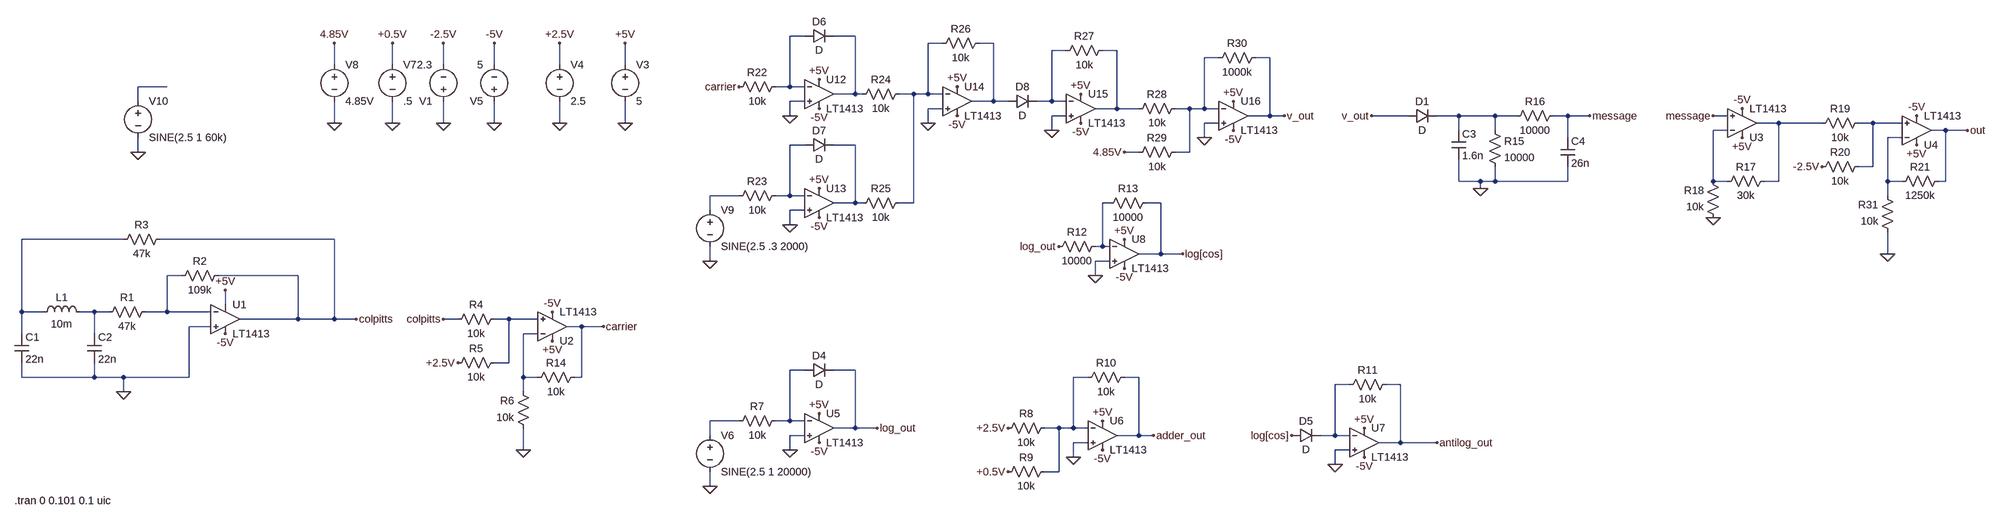
[diagram p0: schematic Draft1.asc]
Draft1.asc, the LTspice schematic file:
Version 4
SHEET 1 2880 1136
WIRE -16 -160 -48 -160
WIRE 96 -160 48 -160
WIRE 288 -144 256 -144
WIRE 400 -144 368 -144
WIRE 560 -128 528 -128
WIRE 672 -128 640 -128
WIRE 896 -112 864 -112
WIRE 1008 -112 976 -112
WIRE -1056 -96 -1056 -144
WIRE -928 -96 -928 -144
WIRE -816 -96 -816 -144
WIRE -704 -96 -704 -144
WIRE -560 -96 -560 -144
WIRE -416 -96 -416 -144
WIRE -1424 -48 -1488 -48
WIRE -48 -48 -48 -160
WIRE -48 -48 -80 -48
WIRE -16 -48 -48 -48
WIRE 96 -32 96 -160
WIRE 96 -32 48 -32
WIRE 112 -32 96 -32
WIRE 224 -32 192 -32
WIRE 256 -32 256 -144
WIRE 256 -32 224 -32
WIRE 288 -32 256 -32
WIRE -1488 -16 -1488 -48
WIRE -16 -16 -48 -16
WIRE 400 -16 400 -144
WIRE 400 -16 352 -16
WIRE 432 -16 400 -16
WIRE 528 -16 528 -128
WIRE 528 -16 496 -16
WIRE 560 -16 528 -16
WIRE 288 0 256 0
WIRE 672 0 672 -128
WIRE 672 0 624 0
WIRE 720 0 672 0
WIRE 832 0 800 0
WIRE 864 0 864 -112
WIRE 864 0 832 0
WIRE 896 0 864 0
WIRE -48 16 -48 -16
WIRE 560 16 528 16
WIRE 1008 16 1008 -112
WIRE 1008 16 960 16
WIRE 1040 16 1008 16
WIRE 1312 16 1232 16
WIRE 1424 16 1376 16
WIRE 1504 16 1424 16
WIRE 1552 16 1504 16
WIRE 1664 16 1632 16
WIRE 1712 16 1664 16
WIRE 2016 16 1984 16
WIRE -1056 32 -1056 -16
WIRE -928 32 -928 -16
WIRE -816 32 -816 -16
WIRE -704 32 -704 -16
WIRE -560 32 -560 -16
WIRE -416 32 -416 -16
WIRE 256 32 256 0
WIRE 896 32 864 32
WIRE 2128 32 2080 32
WIRE 2224 32 2128 32
WIRE 2336 32 2304 32
WIRE 2400 32 2336 32
WIRE 528 48 528 16
WIRE 1424 48 1424 16
WIRE 1504 48 1504 16
WIRE 2016 48 1984 48
WIRE 2496 48 2464 48
WIRE 2544 48 2496 48
WIRE 864 64 864 32
WIRE 1664 64 1664 16
WIRE 2400 64 2368 64
WIRE -16 80 -48 80
WIRE 96 80 48 80
WIRE -1488 96 -1488 64
WIRE 720 96 688 96
WIRE 832 96 832 0
WIRE 832 96 800 96
WIRE 2336 128 2336 32
WIRE 2336 128 2304 128
WIRE 1424 160 1424 112
WIRE 1472 160 1424 160
WIRE 1504 160 1504 128
WIRE 1504 160 1472 160
WIRE 1664 160 1664 128
WIRE 1664 160 1504 160
WIRE 1984 160 1984 48
WIRE 2016 160 1984 160
WIRE 2128 160 2128 32
WIRE 2128 160 2096 160
WIRE 2368 160 2368 64
WIRE 2400 160 2368 160
WIRE 2496 160 2496 48
WIRE 2496 160 2480 160
WIRE 1472 176 1472 160
WIRE -160 192 -224 192
WIRE -48 192 -48 80
WIRE -48 192 -80 192
WIRE -16 192 -48 192
WIRE 2368 192 2368 160
WIRE 96 208 96 80
WIRE 96 208 48 208
WIRE 112 208 96 208
WIRE 224 208 224 -32
WIRE 224 208 192 208
WIRE 656 208 640 208
WIRE 768 208 736 208
WIRE -224 224 -224 192
WIRE -16 224 -48 224
WIRE -48 256 -48 224
WIRE -1520 288 -1744 288
WIRE -1056 288 -1440 288
WIRE 640 304 640 208
WIRE 640 304 624 304
WIRE 656 304 640 304
WIRE 768 320 768 208
WIRE 768 320 720 320
WIRE 816 320 768 320
WIRE 2368 320 2368 272
WIRE -224 336 -224 304
WIRE 656 336 624 336
WIRE -1392 368 -1424 368
WIRE -1136 368 -1312 368
WIRE 624 368 624 336
WIRE -1296 432 -1296 400
WIRE -1744 448 -1744 288
WIRE -1696 448 -1744 448
WIRE -1584 448 -1616 448
WIRE -1552 448 -1584 448
WIRE -1424 448 -1424 368
WIRE -1424 448 -1472 448
WIRE -1328 448 -1424 448
WIRE -1136 464 -1136 368
WIRE -1136 464 -1264 464
WIRE -1056 464 -1056 288
WIRE -1056 464 -1136 464
WIRE -1008 464 -1056 464
WIRE -784 464 -816 464
WIRE -672 464 -704 464
WIRE -608 464 -672 464
WIRE -1328 480 -1376 480
WIRE -512 480 -544 480
WIRE -464 480 -512 480
WIRE -1744 496 -1744 448
WIRE -1584 496 -1584 448
WIRE -608 496 -640 496
WIRE -672 560 -672 464
WIRE -672 560 -704 560
WIRE -16 576 -48 576
WIRE 96 576 48 576
WIRE -1744 592 -1744 560
WIRE -1584 592 -1584 560
WIRE -1584 592 -1744 592
WIRE -1520 592 -1584 592
WIRE -1376 592 -1376 480
WIRE -1376 592 -1520 592
WIRE -640 592 -640 496
WIRE -608 592 -640 592
WIRE -512 592 -512 480
WIRE -512 592 -528 592
WIRE 608 592 576 592
WIRE 720 592 688 592
WIRE 1184 608 1152 608
WIRE 1296 608 1264 608
WIRE -1520 624 -1520 592
WIRE -640 624 -640 592
WIRE -160 688 -224 688
WIRE -48 688 -48 576
WIRE -48 688 -80 688
WIRE -16 688 -48 688
WIRE 96 704 96 576
WIRE 96 704 48 704
WIRE 144 704 96 704
WIRE 544 704 512 704
WIRE 576 704 576 592
WIRE 576 704 544 704
WIRE 608 704 576 704
WIRE -224 720 -224 688
WIRE -16 720 -48 720
WIRE 720 720 720 592
WIRE 720 720 672 720
WIRE 752 720 720 720
WIRE 1152 720 1152 608
WIRE 1152 720 1120 720
WIRE 1184 720 1152 720
WIRE 608 736 576 736
WIRE 1296 736 1296 608
WIRE 1296 736 1248 736
WIRE 1376 736 1296 736
WIRE -640 752 -640 704
WIRE -48 752 -48 720
WIRE 1184 752 1152 752
WIRE 576 768 576 736
WIRE 1152 784 1152 752
WIRE 544 800 544 704
WIRE 544 800 512 800
WIRE -224 832 -224 800
FLAG -416 32 0
FLAG -560 32 0
FLAG -560 -144 +2.5V
FLAG -416 -144 +5V
FLAG -704 -144 -5V
FLAG -704 32 0
FLAG 16 672 +5V
FLAG 16 736 -5V
FLAG -48 752 0
FLAG -224 832 0
FLAG 144 704 log_out
FLAG 640 688 +5V
FLAG 640 752 -5V
FLAG 576 768 0
FLAG 432 704 +2.5V
FLAG 752 720 adder_out
FLAG -928 32 0
FLAG -928 -144 +0.5V
FLAG 432 800 +0.5V
FLAG 1216 704 +5V
FLAG 1216 768 -5V
FLAG 1152 784 0
FLAG 544 304 log_out
FLAG 816 320 log[cos]
FLAG 688 288 +5V
FLAG 688 352 -5V
FLAG 624 368 0
FLAG 1056 720 log[cos]
FLAG 1376 736 antilog_out
FLAG -1056 32 0
FLAG -1056 -144 4.85V
FLAG 16 -64 +5V
FLAG 16 176 +5V
FLAG 320 -48 +5V
FLAG 592 -32 +5V
FLAG -224 336 0
FLAG 16 0 -5V
FLAG 16 240 -5V
FLAG 320 16 -5V
FLAG 592 32 -5V
FLAG -48 16 0
FLAG -48 256 0
FLAG 256 32 0
FLAG 528 48 0
FLAG -1488 96 0
FLAG 1040 16 v_out
FLAG 928 -16 +5V
FLAG 928 48 -5V
FLAG 864 64 0
FLAG 688 96 4.85V
FLAG -160 -48 carrier
FLAG -1296 400 +5V
FLAG -1520 624 0
FLAG -1296 496 -5V
FLAG -576 512 +5V
FLAG -576 448 -5V
FLAG -464 480 carrier
FLAG -784 560 +2.5V
FLAG -640 752 0
FLAG 1232 16 v_out
FLAG 1712 16 message
FLAG 1472 176 0
FLAG -816 464 colpitts
FLAG -1008 464 colpitts
FLAG 2048 64 +5V
FLAG 2048 0 -5V
FLAG 1984 16 message
FLAG 1984 240 0
FLAG 2432 80 +5V
FLAG 2432 16 -5V
FLAG 2544 48 out
FLAG 2224 128 -2.5V
FLAG 2368 320 0
FLAG -816 32 0
FLAG -816 -144 -2.5V
SYMBOL voltage -416 -112 R0
WINDOW 123 0 0 Left 0
WINDOW 39 0 0 Left 0
SYMATTR InstName V3
SYMATTR Value 5
SYMBOL voltage -560 -112 R0
WINDOW 123 0 0 Left 0
WINDOW 39 0 0 Left 0
SYMATTR InstName V4
SYMATTR Value 2.5
SYMBOL voltage -704 0 R180
WINDOW 123 0 0 Left 0
WINDOW 39 0 0 Left 0
SYMATTR InstName V5
SYMATTR Value 5
SYMBOL Opamps\\LT1413 16 640 R0
SYMATTR InstName U5
SYMBOL res -64 672 R90
WINDOW 0 0 56 VBottom 2
WINDOW 3 32 56 VTop 2
SYMATTR InstName R7
SYMATTR Value 10k
SYMBOL diode -16 592 R270
WINDOW 0 32 32 VTop 2
WINDOW 3 0 32 VBottom 2
SYMATTR InstName D4
SYMBOL voltage -224 704 R0
WINDOW 123 0 0 Left 0
WINDOW 39 0 0 Left 0
SYMATTR InstName V6
SYMATTR Value SINE(2.5 1 20000)
SYMBOL res 528 688 R90
WINDOW 0 0 56 VBottom 2
WINDOW 3 32 56 VTop 2
SYMATTR InstName R8
SYMATTR Value 10k
SYMBOL res 528 784 R90
WINDOW 0 0 56 VBottom 2
WINDOW 3 32 56 VTop 2
SYMATTR InstName R9
SYMATTR Value 10k
SYMBOL Opamps\\LT1413 640 656 R0
SYMATTR InstName U6
SYMBOL res 704 576 R90
WINDOW 0 0 56 VBottom 2
WINDOW 3 32 56 VTop 2
SYMATTR InstName R10
SYMATTR Value 10k
SYMBOL voltage -928 -112 R0
WINDOW 123 0 0 Left 0
WINDOW 39 0 0 Left 0
SYMATTR InstName V7
SYMATTR Value .5
SYMBOL diode 1056 736 R270
WINDOW 0 32 32 VTop 2
WINDOW 3 0 32 VBottom 2
SYMATTR InstName D5
SYMBOL Opamps\\LT1413 1216 672 R0
SYMATTR InstName U7
SYMBOL res 1280 592 R90
WINDOW 0 0 56 VBottom 2
WINDOW 3 32 56 VTop 2
SYMATTR InstName R11
SYMATTR Value 10k
SYMBOL Opamps\\LT1413 688 256 R0
SYMATTR InstName U8
SYMBOL res 640 288 R90
WINDOW 0 0 56 VBottom 2
WINDOW 3 32 56 VTop 2
SYMATTR InstName R12
SYMATTR Value 10000
SYMBOL res 752 192 R90
WINDOW 0 0 56 VBottom 2
WINDOW 3 32 56 VTop 2
SYMATTR InstName R13
SYMATTR Value 10000
SYMBOL voltage -1056 -112 R0
WINDOW 123 0 0 Left 0
WINDOW 39 0 0 Left 0
SYMATTR InstName V8
SYMATTR Value 4.85V
SYMBOL Opamps\\LT1413 16 -96 R0
SYMATTR InstName U12
SYMBOL Opamps\\LT1413 16 144 R0
SYMATTR InstName U13
SYMBOL res -64 -64 R90
WINDOW 0 0 56 VBottom 2
WINDOW 3 32 56 VTop 2
SYMATTR InstName R22
SYMATTR Value 10k
SYMBOL res -64 176 R90
WINDOW 0 0 56 VBottom 2
WINDOW 3 32 56 VTop 2
SYMATTR InstName R23
SYMATTR Value 10k
SYMBOL diode -16 -144 R270
WINDOW 0 32 32 VTop 2
WINDOW 3 0 32 VBottom 2
SYMATTR InstName D6
SYMBOL diode -16 96 R270
WINDOW 0 32 32 VTop 2
WINDOW 3 0 32 VBottom 2
SYMATTR InstName D7
SYMBOL res 208 -48 R90
WINDOW 0 0 56 VBottom 2
WINDOW 3 32 56 VTop 2
SYMATTR InstName R24
SYMATTR Value 10k
SYMBOL res 208 192 R90
WINDOW 0 0 56 VBottom 2
WINDOW 3 32 56 VTop 2
SYMATTR InstName R25
SYMATTR Value 10k
SYMBOL Opamps\\LT1413 320 -80 R0
SYMATTR InstName U14
SYMBOL res 384 -160 R90
WINDOW 0 0 56 VBottom 2
WINDOW 3 32 56 VTop 2
SYMATTR InstName R26
SYMATTR Value 10k
SYMBOL diode 432 0 R270
WINDOW 0 32 32 VTop 2
WINDOW 3 0 32 VBottom 2
SYMATTR InstName D8
SYMBOL Opamps\\LT1413 592 -64 R0
SYMATTR InstName U15
SYMBOL res 656 -144 R90
WINDOW 0 0 56 VBottom 2
WINDOW 3 32 56 VTop 2
SYMATTR InstName R27
SYMATTR Value 10k
SYMBOL voltage -224 208 R0
WINDOW 123 0 0 Left 0
WINDOW 39 0 0 Left 0
SYMATTR InstName V9
SYMATTR Value SINE(2.5 .3 2000)
SYMBOL voltage -1488 -32 R0
WINDOW 123 0 0 Left 0
WINDOW 39 0 0 Left 0
SYMATTR InstName V10
SYMATTR Value SINE(2.5 1 60k)
SYMBOL res 816 -16 R90
WINDOW 0 0 56 VBottom 2
WINDOW 3 32 56 VTop 2
SYMATTR InstName R28
SYMATTR Value 10k
SYMBOL res 816 80 R90
WINDOW 0 0 56 VBottom 2
WINDOW 3 32 56 VTop 2
SYMATTR InstName R29
SYMATTR Value 10k
SYMBOL Opamps\\LT1413 928 -48 R0
SYMATTR InstName U16
SYMBOL res 992 -128 R90
WINDOW 0 0 56 VBottom 2
WINDOW 3 32 56 VTop 2
SYMATTR InstName R30
SYMATTR Value 1000k
SYMBOL ind -1712 464 R270
WINDOW 0 32 56 VTop 2
WINDOW 3 5 56 VBottom 2
SYMATTR InstName L1
SYMATTR Value 10m
SYMBOL res -1456 432 R90
WINDOW 0 0 56 VBottom 2
WINDOW 3 32 56 VTop 2
SYMATTR InstName R1
SYMATTR Value 47k
SYMBOL res -1296 352 R90
WINDOW 0 0 56 VBottom 2
WINDOW 3 32 56 VTop 2
SYMATTR InstName R2
SYMATTR Value 109k
SYMBOL res -1424 272 R90
WINDOW 0 0 56 VBottom 2
WINDOW 3 32 56 VTop 2
SYMATTR InstName R3
SYMATTR Value 47k
SYMBOL cap -1760 496 R0
SYMATTR InstName C1
SYMATTR Value 22n
SYMBOL cap -1600 496 R0
SYMATTR InstName C2
SYMATTR Value 22n
SYMBOL Opamps\\LT1413 -1296 400 R0
SYMATTR InstName U1
SYMBOL res -688 448 R90
WINDOW 0 0 56 VBottom 2
WINDOW 3 32 56 VTop 2
SYMATTR InstName R4
SYMATTR Value 10k
SYMBOL res -688 544 R90
WINDOW 0 0 56 VBottom 2
WINDOW 3 32 56 VTop 2
SYMATTR InstName R5
SYMATTR Value 10k
SYMBOL Opamps\\LT1413 -576 544 M180
SYMATTR InstName U2
SYMBOL res -512 576 R90
WINDOW 0 0 56 VBottom 2
WINDOW 3 32 56 VTop 2
SYMATTR InstName R14
SYMATTR Value 10k
SYMBOL res -624 720 R180
WINDOW 0 36 76 Left 2
WINDOW 3 36 40 Left 2
SYMATTR InstName R6
SYMATTR Value 10k
SYMBOL diode 1312 32 R270
WINDOW 0 32 32 VTop 2
WINDOW 3 0 32 VBottom 2
SYMATTR InstName D1
SYMBOL res 1488 32 R0
SYMATTR InstName R15
SYMATTR Value 10000
SYMBOL cap 1408 48 R0
SYMATTR InstName C3
SYMATTR Value 1.6n
SYMBOL res 1648 0 R90
WINDOW 0 0 56 VBottom 2
WINDOW 3 32 56 VTop 2
SYMATTR InstName R16
SYMATTR Value 10000
SYMBOL cap 1648 64 R0
SYMATTR InstName C4
SYMATTR Value 26n
SYMBOL Opamps\\LT1413 2048 96 M180
SYMATTR InstName U3
SYMBOL res 2112 144 R90
WINDOW 0 0 56 VBottom 2
WINDOW 3 32 56 VTop 2
SYMATTR InstName R17
SYMATTR Value 30k
SYMBOL res 2000 256 R180
WINDOW 0 36 76 Left 2
WINDOW 3 36 40 Left 2
SYMATTR InstName R18
SYMATTR Value 10k
SYMBOL res 2320 16 R90
WINDOW 0 0 56 VBottom 2
WINDOW 3 32 56 VTop 2
SYMATTR InstName R19
SYMATTR Value 10k
SYMBOL res 2320 112 R90
WINDOW 0 0 56 VBottom 2
WINDOW 3 32 56 VTop 2
SYMATTR InstName R20
SYMATTR Value 10k
SYMBOL Opamps\\LT1413 2432 112 M180
SYMATTR InstName U4
SYMBOL res 2496 144 R90
WINDOW 0 0 56 VBottom 2
WINDOW 3 32 56 VTop 2
SYMATTR InstName R21
SYMATTR Value 1250k
SYMBOL res 2384 288 R180
WINDOW 0 36 76 Left 2
WINDOW 3 36 40 Left 2
SYMATTR InstName R31
SYMATTR Value 10k
SYMBOL voltage -816 0 R180
WINDOW 123 0 0 Left 0
WINDOW 39 0 0 Left 0
SYMATTR InstName V1
SYMATTR Value 2.3
TEXT -1760 864 Left 2 !.tran 0 0.101 0.1 uic

The netlist it stands for:
* Draft1.asc
V3 +5V 0 5
V4 +2.5V 0 2.5
V5 0 -5V 5
XU5 0 N023 +5V -5V log_out LT1413  ; pins In+ In- V+ V- OUT
R7 N023 N026 10k
D4 N023 log_out D
V6 N026 0 SINE(2.5 1 20000)
R8 N024 +2.5V 10k
R9 N024 +0.5V 10k
XU6 0 N024 +5V -5V adder_out LT1413  ; pins In+ In- V+ V- OUT
R10 adder_out N024 10k
V7 +0.5V 0 .5
D5 log[cos] N025 D
XU7 0 N025 +5V -5V antilog_out LT1413  ; pins In+ In- V+ V- OUT
R11 antilog_out N025 10k
XU8 0 N017 +5V -5V log[cos] LT1413  ; pins In+ In- V+ V- OUT
R12 N017 log_out 10000
R13 log[cos] N017 10000
V8 4.85V 0 4.85V
XU12 0 N001 +5V -5V N002 LT1413  ; pins In+ In- V+ V- OUT
XU13 0 N014 +5V -5V N015 LT1413  ; pins In+ In- V+ V- OUT
R22 N001 carrier 10k
R23 N014 N016 10k
D6 N001 N002 D
D7 N014 N015 D
R24 N003 N002 10k
R25 N003 N015 10k
XU14 0 N003 +5V -5V N004 LT1413  ; pins In+ In- V+ V- OUT
R26 N004 N003 10k
D8 N004 N005 D
XU15 0 N005 +5V -5V N006 LT1413  ; pins In+ In- V+ V- OUT
R27 N006 N005 10k
V9 N016 0 SINE(2.5 .3 2000)
V10 N008 0 SINE(2.5 1 60k)
R28 N007 N006 10k
R29 N007 4.85V 10k
XU16 0 N007 +5V -5V v_out LT1413  ; pins In+ In- V+ V- OUT
R30 v_out N007 1000k
L1 N018 N020 10m
R1 N019 N020 47k
R2 colpitts N019 109k
R3 colpitts N018 47k
C1 N018 0 22n
C2 N020 0 22n
XU1 0 N019 +5V -5V colpitts LT1413  ; pins In+ In- V+ V- OUT
R4 N021 colpitts 10k
R5 N021 +2.5V 10k
XU2 N021 N022 +5V -5V carrier LT1413  ; pins In+ In- V+ V- OUT
R14 carrier N022 10k
R6 0 N022 10k
D1 v_out N009 D
R15 N009 0 10000
C3 N009 0 1.6n
R16 message N009 10000
C4 message 0 26n
XU3 message N012 +5V -5V N010 LT1413  ; pins In+ In- V+ V- OUT
R17 N010 N012 30k
R18 0 N012 10k
R19 N011 N010 10k
R20 N011 -2.5V 10k
XU4 N011 N013 +5V -5V out LT1413  ; pins In+ In- V+ V- OUT
R21 out N013 1250k
R31 0 N013 10k
V1 0 -2.5V 2.3
.model D D
.lib standard.dio
.tran 0 0.101 0.1 uic
.lib LTC.lib
.backanno
.end

* Results of the author's LTspice run, read from the files saved beside the schematic
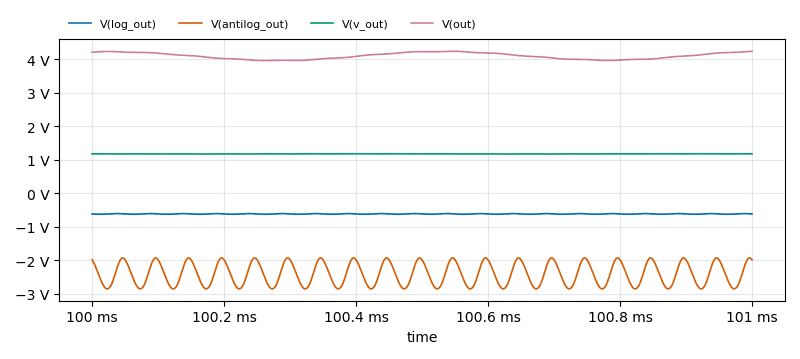
[diagram p1: Transient Analysis of Draft1.asc, plotted from the saved traces]
* Transient Analysis, 1 run:
*   V(log_out): min -628 mV, max -606 mV, average -618.2 mV, rms 618.2 mV, last -618.9 mV
*   V(antilog_out): min -2.853 V, max -1.93 V, average -2.408 V, rms 2.43 V, last -1.984 V
*   V(v_out): min 1.169 V, max 1.177 V, average 1.173 V, rms 1.173 V, last 1.174 V
*   V(out): min 3.957 V, max 4.236 V, average 4.097 V, rms 4.098 V, last 4.236 V